# EAGLE schematic IR_module_V0_2 (EAGLE 7.2.0)
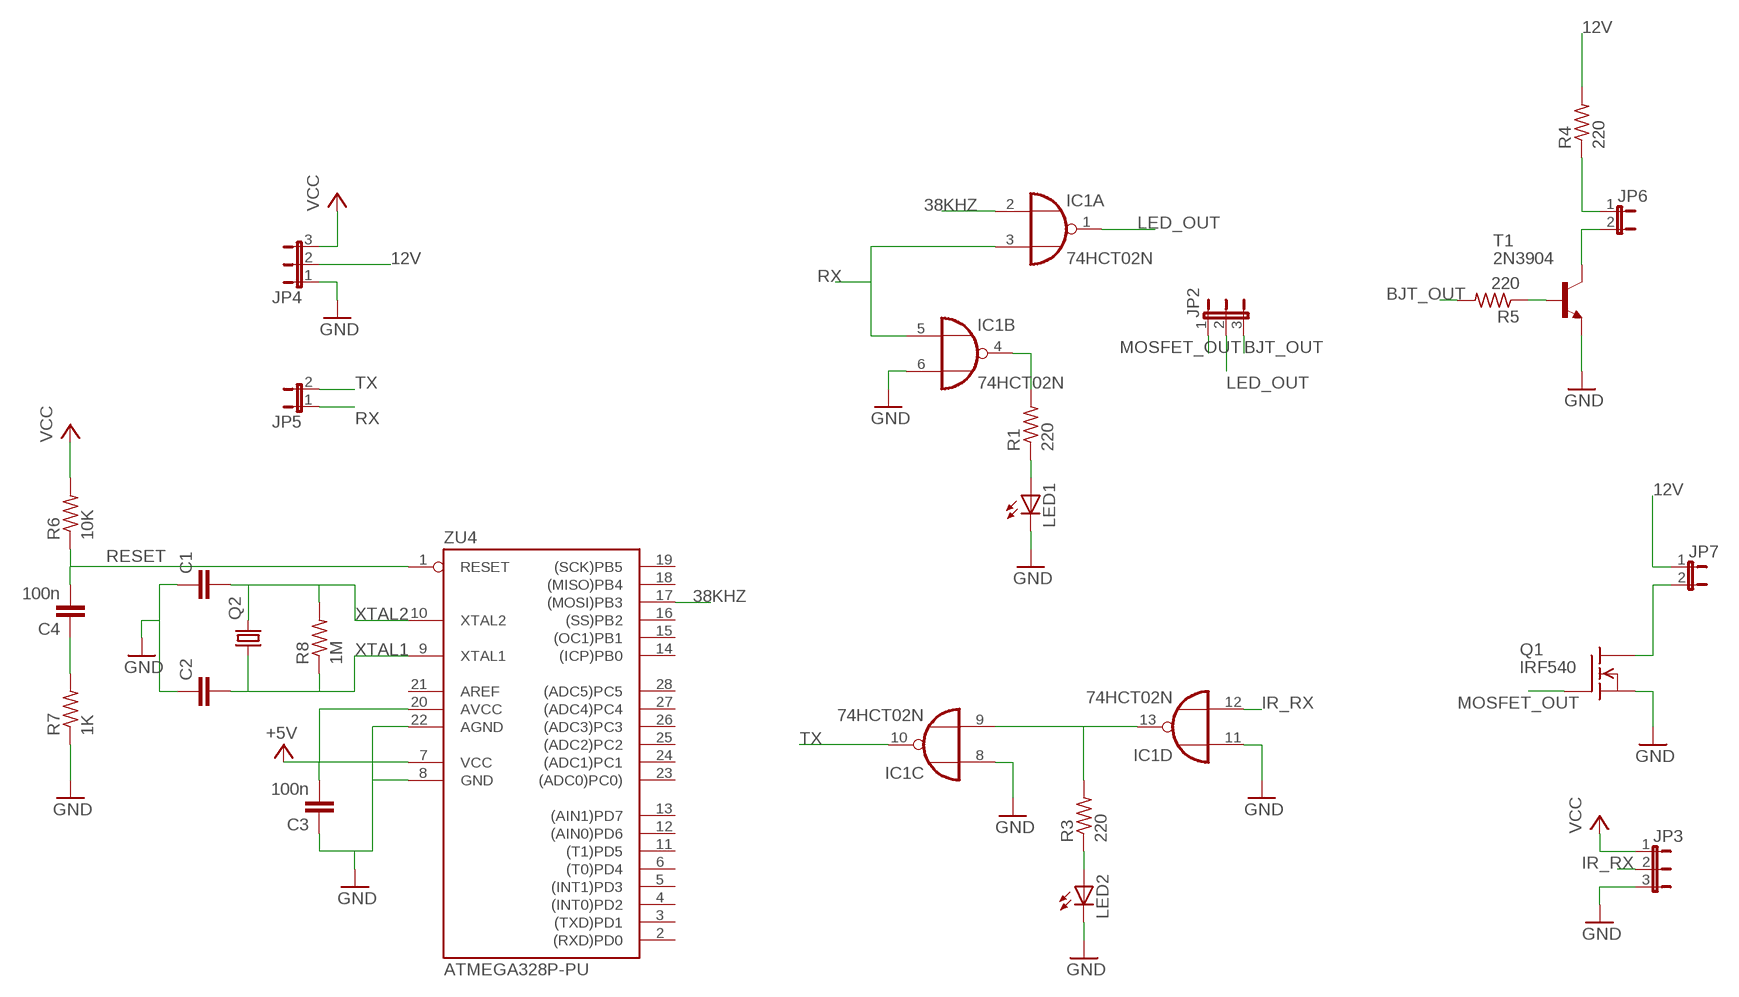
[diagram p0: schematic, sheet 1]

## Parts
C1  CAPPTH3  [CAP-PTH-LARGE]
C2  CAPPTH3  [CAP-PTH-LARGE]
C3  100n  CAPPTH3  [CAP-PTH-LARGE]
C4  100n  CAPPTH3  [CAP-PTH-LARGE]
IC1  74HCT02N  [DIL14]
JP2  JP2E  [JP2]
JP3  JP2W  [JP2W]
JP4  JP2E  [JP2]
JP5  JP1E  [JP1]
JP6  JP1E  [JP1]
JP7  JP1E  [JP1]
LED1  LED5MM  [LED5MM]
LED2  LED5MM  [LED5MM]
Q1  IRF540  [TO220]
Q2  CRYSTALHC49S  [HC49/S]
R1  220  R-US_0207/10  [0207/10]
R3  220  R-US_0207/10  [0207/10]
R4  220  R-US_0207/10  [0207/10]
R5  220  R-US_0207/10  [0207/10]
R6  10K  R-US_0207/10  [0207/10]
R7  1K  R-US_0207/10  [0207/10]
R8  1M  R-US_0207/10  [0207/10]
T1  2N3904  [TO92]
ZU4  ATMEGA328P-PU  [DIL28-3]

## Nets
12V: JP4.2 JP7.1 R4.2
38KHZ: IC1.2(A:I0) ZU4.17((MOSI)PB3)
+5V [usbvcc]: C3.2 ZU4.7(VCC) ZU4.20(AVCC)
BJT_OUT: JP2.3 R5.2
GND [gnd]: C1.1 C2.1 C3.1 IC1.6(B:I1) IC1.8(C:I0) IC1.11(D:I0) JP3.3 JP4.1 LED1.K(C) LED2.K(C) Q1.3(S) R7.1 T1.3(E) ZU4.8(GND) ZU4.22(AGND)
IR_RX: IC1.12(D:I1) JP3.2
LED_OUT: IC1.1(A:O) JP2.2
MOSFET_OUT: JP2.1 Q1.1(G)
N$1: JP6.2 T1.1(C)
N$2: IC1.4(B:O) R1.2
N$3: LED1.A R1.1
N$4: IC1.9(C:I1) IC1.13(D:O) R3.2
N$5: LED2.A R3.1
N$6: JP6.1 R4.1
N$7: R5.1 T1.2(B)
N$8: JP7.2 Q1.2(D)
N$9: C4.1 R7.2
RESET: C4.2 R6.1 ZU4.1(RESET)
RX: IC1.3(A:I1) IC1.5(B:I0) JP5.1
TX: IC1.10(C:O) JP5.2
VCC: JP3.1 JP4.3 R6.2
XTAL1: C2.2 Q2.1 R8.1 ZU4.9(XTAL1)
XTAL2: C1.2 Q2.2 R8.2 ZU4.10(XTAL2)
Unconnected: ZU4.2((RXD)PD0) ZU4.3((TXD)PD1) ZU4.4((INT0)PD2) ZU4.5((INT1)PD3) ZU4.6((T0)PD4) ZU4.11((T1)PD5) ZU4.12((AIN0)PD6) ZU4.13((AIN1)PD7) ZU4.14((ICP)PB0) ZU4.15((OC1)PB1) ZU4.16((SS)PB2) ZU4.18((MISO)PB4) ZU4.19((SCK)PB5) ZU4.21(AREF) ZU4.23((ADC0)PC0)) ZU4.24((ADC1)PC1) ZU4.25((ADC2)PC2) ZU4.26((ADC3)PC3) ZU4.27((ADC4)PC4) ZU4.28((ADC5)PC5)

## Power pins joined to a net without a drawn wire
GND: IC1.7(P:GND)
VCC: IC1.14(P:VCC)

## Library data of the parts
C1-C4 = SparkFun-Passives:CAP: Capacitor Standard 0603 ceramic capacitor, and 0.1" leaded capacitor.
IC1 = 74xx-eu:74*02: Quad 2-input NOR gate
JP2 JP4 = jumper:JP2E: JUMPER
JP3 = jumper:JP2W: JUMPER
JP5-JP7 = jumper:JP1E: JUMPER
LED1 LED2 = led:LED: LED OSRAM: - CHIPLED LG R971, LG N971, LY N971, LG Q971, LY Q971, LO R971, LY R971 LH N974, LH R974 LS Q976, LO Q976, LY Q976 LO Q996 - Hyper CHIPLED LW Q18S LB Q993, LB Q99A, LB R99A - SideLED LS A670, LO A670, LY A670, LG A670, LP A670 LB A673, LV A673, LT A673, LW A673 LH A674 LY A675 LS A676, LA A676, LO A676, LY A676, LW A676 LS A679, LY A679, LG A679 - Hyper Micro SIDELED® LS Y876, LA Y876, LO Y876, LY Y876 LT Y87S - SmartLED LW L88C, LW L88S LB L89C, LB L89S, LG L890 LS L89K, LO L89K, LY L89K LS L896, LA L896, LO L896, LY L896 - TOPLED LS T670, LO T670, LY T670, LG T670, LP T670 LSG T670, LSP T670, LSY T670, LOP T670, LYG T670 LG T671, LOG T671, LSG T671 LB T673, LV T673, LT T673, LW T673 LH T674 LS T676, LA T676, LO T676, LY T676, LB T676, LH T676, LSB T676, LW T676 LB T67C, LV T67C, LT T67C, LS T67K, LO T67K, LY T67K, LW E67C LS E67B, LA E67B, LO E67B, LY E67B, LB E67C, LV E67C, LT E67C LW T67C LS T679, LY T679, LG T679 LS T770, LO T770, LY T770, LG T770, LP T770 LB T773, LV T773, LT T773, LW T773 LH T774 LS E675, LA E675, LY E675, LS T675 LS T776, LA T776, LO T776, LY T776, LB T776 LHGB T686 LT T68C, LB T68C - Hyper Mini TOPLED® LB M676 - Mini TOPLED Santana® LG M470 LS M47K, LO M47K, LY M47K Source: http://www.osram.convergy.de LUXEON: - LUMILED® LXK2-PW12-R00, LXK2-PW12-S00, LXK2-PW14-U00, LXK2-PW14-V00 LXK2-PM12-R00, LXK2-PM12-S00, LXK2-PM14-U00 LXK2-PE12-Q00, LXK2-PE12-R00, LXK2-PE12-S00, LXK2-PE14-T00, LXK2-PE14-U00 LXK2-PB12-K00, LXK2-PB12-L00, LXK2-PB12-M00, LXK2-PB14-N00, LXK2-PB14-P00, LXK2-PB14-Q00 LXK2-PR12-L00, LXK2-PR12-M00, LXK2-PR14-Q00, LXK2-PR14-R00 LXK2-PD12-Q00, LXK2-PD12-R00, LXK2-PD12-S00 LXK2-PH12-R00, LXK2-PH12-S00 LXK2-PL12-P00, LXK2-PL12-Q00, LXK2-PL12-R00 Source: www.luxeon.com KINGBRIGHT: KA-3528ASYC Source: www.kingbright.com
Q1 = transistor-fet:IRF540: N-Channel Enhancement MOSFET (HEXFET); 100V; 28A; 0,077Ohm
Q2 = crystal:CRYSTAL: CRYSTAL; OC_FARNELL: 1667008; OC_NEWARK: unknown
R1 R3-R8 = rcl:R-US_: RESISTOR, American symbol
T1 = transistor:2N3904: NPN TRANSISTOR
ZU4 = SmartPrj:ATMEGA328P-: MICROCONTROLLER 4 Kbytes FLASH 128 bytes SRAM 256 bytes EEPROM UART 6-channel 10 bit ADC

## Net classes
0 default: width 0.254 mm, clearance 0.254 mm
1 power: width 0.61 mm, drill 0.61 mm, clearance 0.254 mm
2 gnd: width 0.305 mm, drill 0.559 mm, clearance 0.254 mm
3 usbvcc: width 0.508 mm, drill 0.61 mm, clearance 0.254 mm
4 aref: width 0.406 mm, drill 0.61 mm, clearance 0.254 mm